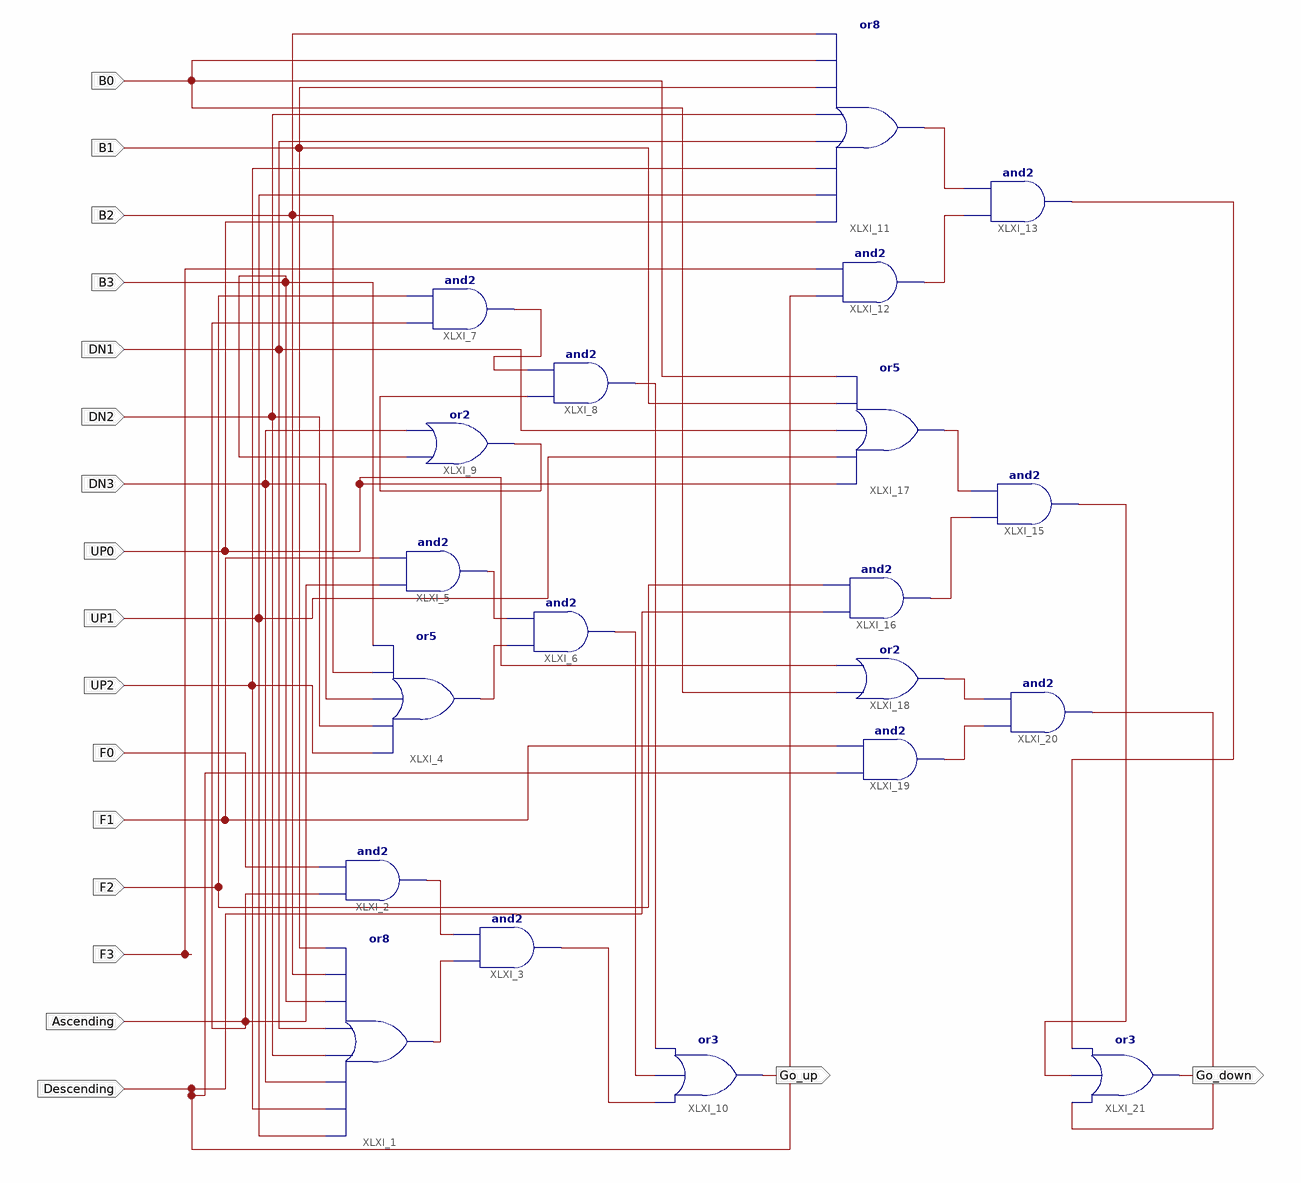
[diagram p0: schematic sheet 1]
// Xilinx ISE schematic 2018CS50411_2018CS50413.sch (spartan6) as structural Verilog: 20 symbols, 18 ports
module \2018CS50411_2018CS50413  (
  input  B0,
  input  B1,
  input  B2,
  input  B3,
  input  DN1,
  input  DN2,
  input  DN3,
  input  UP0,
  input  UP1,
  input  UP2,
  input  F0,
  input  F1,
  input  F2,
  input  F3,
  input  Ascending,
  input  Descending,
  output Go_up,
  output Go_down
);

  wire XLXN_18, XLXN_19, XLXN_21, XLXN_22, XLXN_23, XLXN_24, XLXN_26, XLXN_28, XLXN_29, XLXN_37, XLXN_38,
       XLXN_39, XLXN_40, XLXN_41, XLXN_42, XLXN_43, XLXN_45, XLXN_46;

  or XLXI_1 (XLXN_19, UP1, UP2, DN3, DN2, DN1, B3, B2, B1);
  and XLXI_2 (XLXN_18, Ascending, F0);
  and XLXI_3 (XLXN_29, XLXN_19, XLXN_18);
  or XLXI_4 (XLXN_22, UP2, DN2, DN3, B2, B3);
  and XLXI_5 (XLXN_21, Ascending, F1);
  and XLXI_6 (XLXN_28, XLXN_22, XLXN_21);
  and XLXI_7 (XLXN_23, Ascending, F2);
  and XLXI_8 (XLXN_26, XLXN_24, XLXN_23);
  or XLXI_9 (XLXN_24, B3, DN3);
  or XLXI_10 (Go_up, XLXN_29, XLXN_28, XLXN_26);
  or XLXI_11 (XLXN_37, UP0, UP1, UP2, DN1, DN2, B1, B0, B2);
  and XLXI_12 (XLXN_38, Descending, F3);
  and XLXI_13 (XLXN_43, XLXN_38, XLXN_37);
  and XLXI_15 (XLXN_45, XLXN_40, XLXN_39);
  and XLXI_16 (XLXN_40, Descending, F2);
  or XLXI_17 (XLXN_39, UP0, UP1, DN1, B1, B0);
  or XLXI_18 (XLXN_41, B0, UP0);
  and XLXI_19 (XLXN_42, Descending, F1);
  and XLXI_20 (XLXN_46, XLXN_42, XLXN_41);
  or XLXI_21 (Go_down, XLXN_46, XLXN_45, XLXN_43);
endmodule
